# Altium schematic sheet Howland Channel 2.SchDoc
size A4
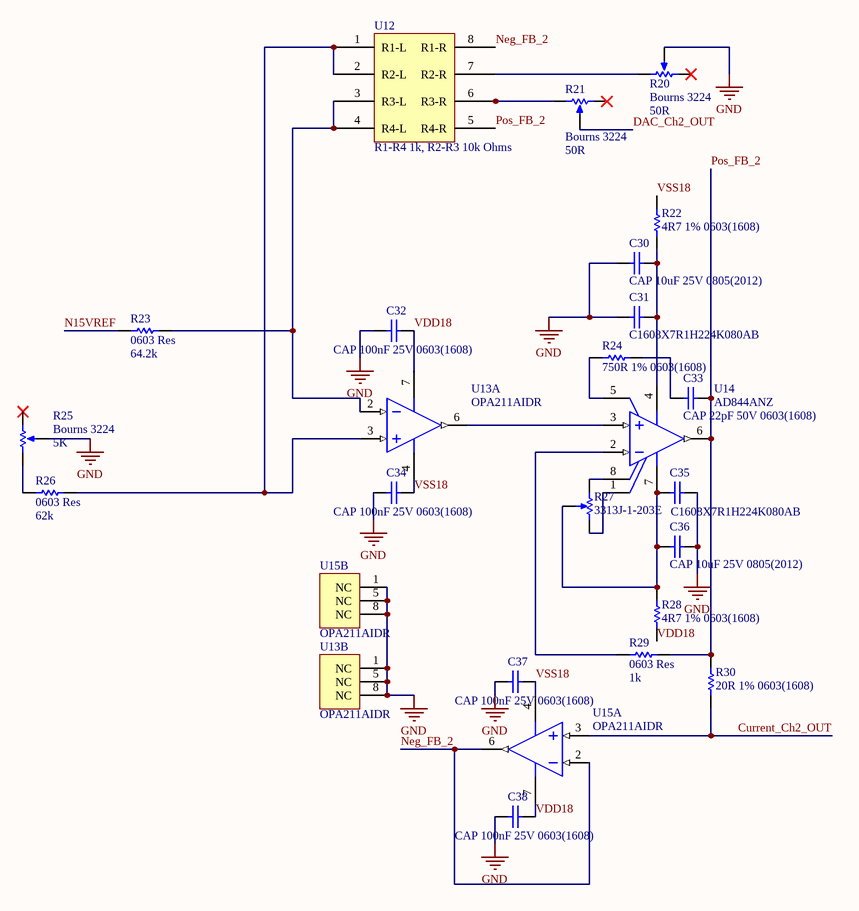
[diagram p0: Howland Channel 2.SchDoc]

## Parts
C30  CAP 10uF 25V 0805(2012)  [CAPC0805(2012)145_N]
C31  C1608X7R1H224K080AB  [TDK-C1608-2_A_M]
C32  CAP 100nF 25V 0603(1608)  [CAPC0603(1608)100_N]
C33  CAP 22pF 50V 0603(1608)  [CAPC0603(1608)100_M]
C34  CAP 100nF 25V 0603(1608)  [CAPC0603(1608)100_N]
C35  C1608X7R1H224K080AB  [TDK-C1608-2_A_M]
C36  CAP 10uF 25V 0805(2012)  [CAPC0805(2012)145_N]
C37  CAP 100nF 25V 0603(1608)  [CAPC0603(1608)100_N]
C38  CAP 100nF 25V 0603(1608)  [CAPC0603(1608)100_N]
R20  Bourns 3224  value 50R  [BOURNS 3224W]
R21  Bourns 3224  value 50R  [BOURNS 3224W]
R22  4R7 1% 0603(1608)  [RESC0603(1608)_M]
R23  0603 Res  value 64.2k  [J1-0603]
R24  750R 1% 0603(1608)  [RESC0603(1608)_L]
R25  Bourns 3224  value 5K  [BOURNS 3224W]
R26  0603 Res  value 62k  [J1-0603]
R27  3313J-1-203E  [BOUR-3313J-1_V]
R28  4R7 1% 0603(1608)  [RESC0603(1608)_M]
R29  0603 Res  value 1k  [J1-0603]
R30  20R 1% 0603(1608)  [RESC0603(1608)_M]
U12  R1-R4 1k, R2-R3 10k Ohms  [0612 (4x0603)]
U13  OPA211AIDR  [TI-D8_L]  (parts A,B of 2)
U14  AD844ANZ  [ADI-N-8]
U15  OPA211AIDR  [TI-D8_L]  (parts A,B of 2)

## Nets
GND: C30.1 C31.1 C32.1 C34.1 C35.2 C36.2 C37.1 C38.1 R20.2(TAP) R25.2(TAP) U13.1(NC) U13.5(NC) U13.8(NC) U15.1(NC) U15.5(NC) U15.8(NC)
Current_Ch2_OUT: R30.1 U15.3(IN+)
DAC_Ch2_OUT: R21.2(TAP)
N15VREF: R23.2
Neg_FB_2: U12.8(R1-R) U15.2(IN-) U15.6(OUT)
Pos_FB_2: C33.2 R29.1 R30.2 U12.5(R4-R) U14.6(OUTPUT)
VDD18: C32.2 C38.2 R28.1 U13.7(V+) U15.7(V+)
VSS18: C34.2 C37.2 R22.2 U13.4(V-) U15.4(V-)
NetC30_2: C30.2 C31.2 R22.1 U14.4(-VS)
NetC33_1: C33.1 R24.2
NetC35_1: C35.1 C36.1 R27.2 R28.2 U14.7(+VS)
NetR20_3: R20.3(BOT) U12.7(R2-R)
NetR21_1: R21.1(TOP) U12.6(R3-R)
NetR23_1: R23.1 U12.3(R3-L) U12.4(R4-L) U13.2(IN-)
NetR24_1: R24.1 U14.5(TZ)
NetR25_1: R25.1(TOP) R26.2
NetR26_1: R26.1 U12.1(R1-L) U12.2(R2-L) U13.3(IN+)
NetR27_1: R27.1 U14.8(NULL)
NetR27_3: R27.3 U14.1(NULL)
NetR29_2: R29.2 U14.2(-IN)
NetU13_6: U13.6(OUT) U14.3(+IN)

Not connected (* = marked no-connect by the designer): R20 1(TOP)*; R21 3(BOT)*; R25 3(BOT)*

## Library data of the parts
C30 C36 = CMP-1036-04932-1: CAP 10uF 25V ±10% 0805 (2012 Metric) Thickness 1.45mm SMD; Case-EIA: 0805; Case-Metric: 2012; Tolerance: Â±10%; Technology: SMT; Value: 10uF; Rated Voltage: 25 V; Max Thickness: 1.45 mm
C31 C35 = CMP-2000-05394-1: Cap Ceramic, 0.22 uF, +/- 10%, -55 to 125 degC, 2-Pin SMD (0603), RoHS, Tape and Reel; Manufacturer: TDK; PCN Part Number: MLCCPartNumberChange30/Nov/2012; Capacitance: 0.22µF; Other Names: 445-7408-1; Design Resources: 20WNon-IsolatedBuckLEDDriverUsingPLLNK460KG; Online Catalog: CSeries,GeneralPurpose; Kits: 445-9014-KIT-ND-KITMLCC100PF-22UF060310-50V445-9003-KIT-ND-KITCAPCERHICAPMLCCSMD445-173086-KIT-ND-C0402-2220X7R6.3-50V1,000PF-; Temperature Coefficient: X7R; Product Training Modules: CSeriesGeneralApplicationsSEAT,CCV,andTVCLDesignToolsGuidetoReplacinganElectrolyticCapacitorwithanMLCC; Voltage - Rated: 50V; Ratings: -; Lead Spacing: -; Package Description: 2-Pin Chip Capacitor, Body 1.7 x 0.9 mm; Datasheet URL: https://datasheet.ciiva.com/24218/c1608x7r1h224k080ab-264841-24218813.pdf; Applications: GeneralPurpose; Series: C; Manufacturer URL: http://www.tdk.com/; Features: -; Tolerance: ±10%; Package Reference: 603; Family: CeramicCapacitors; Standard Package: 1; RoHS Information: RoHSCertificate-MLCC; Package / Case: 0603(1608Metric); Operating Temperature: -55degC~125degC; Datasheet Version: Sep-13; Mounting Type: SurfaceMount,MLCC; Lead Style: -; Height - Seated (Max): -; Packaging: CutTape(CT); Category: Capacitors
C32 C34 C37 C38 = CMP-1035-02589-1: CAP 100nF 25V ±20% 0603 (1608 Metric) Thickness 1mm SMD; Case-EIA: 0603; Tolerance: Â±20%; Case-Metric: 1608; Value: 100nF; Max Thickness: 1 mm; Technology: SMT; Rated Voltage: 25 V
C33 = CMP-1035-00820-1: CAP 22pF 50V ±2% 0603 (1608 Metric) Thickness 1mm SMD; Case-Metric: 1608; Case-EIA: 0603; Tolerance: Â±2%; Rated Voltage: 50 V; Value: 22pF; Technology: SMT; Max Thickness: 1 mm
R20 R21 R25 = 3224-Series Trimmer Potentiometer: Trimmer Potentiometer, Cermet, 3224-Series (Bourns); Sim Note: Enter the Resistance value and the set point into parameter fields.; Set Position: 0.5; Published: 8-Jun-2000; LatestRevisionDate: 17-Jul-2002; LatestRevisionNote: Re-released for DXP Platform.; PackageReference: VR5; Publisher: Altium Limited; PackageDescription: Variable Resistor, Thru-Hole; 3 Leads
R22 R28 = CMP-1012-00247-1: 4R7 0.1W 1% 0603 (1608 Metric)  SMD; Case-EIA: 0603; Case-Metric: 1608; Value: 4.70 Ohm; Power: 0.1 W; Technology: SMT; Tolerance: 1 %
R23 R26 R29 = Res1: Chip Resistor, 0603, 1%; Published: 8-Jun-2000; LatestRevisionDate: 17-Jul-2002; LatestRevisionNote: Re-released for DXP Platform.; PackageReference: AXIAL-0.3; Publisher: Altium Limited; PackageDescription: Axial Device, Thru-Hole; 2 Leads; 0.3 in Pin Spacing
R24 = CMP-1012-00496-1: 750R 0.1W 1% 0603 (1608 Metric)  SMD; Value: 750.00 Ohm; Case-Metric: 1608; Case-EIA: 0603; Technology: SMT; Tolerance: 1 %; Power: 0.1 W
R27 = CMP-2000-05586-1: 3 mm Trimpot(R) Trimming Potentiometer, 20 KOhm, +/- 20%, 0.125 W, -55 to 125 degC, 3-Pin SMD, RoHS, Tape and Reel; Manufacturer: Bourns; Insulation Resistance: 100Megohms(Min.)@500VDC; Rotational Life: 100Cycles; Resolution: Infinite; Brand/Series: Trimpot®3313-SealedSeries; Temperature, Operating, Maximum: +125°C; Resistance: 20Kilohms; Resistance, Insulation: 100Megohms; Material, Element: Cermet; Standards: RoHSCompliant; Dielectric Strength: 500VAC; Load Life: 1000hr@0.125W,70°C; Torque: 50g-cm; Temperature Coefficient: ±100ppm/°C; Number of Turns: 1; Power, Rating: 0.125W; Angle, Mechanical: 250°; Temperature, Operating, Minimum: -55°C; Package Reference: 3313J-1; Tolerance: ±20%; Type: Trimmer; Package Description: 3-Pin Surface Mount Device, Body 3.5 x 3.2 mm, Pitch 1.15 mm; Mounting Technology: SurfaceMount; Datasheet URL: http://www.bourns.com/docs/Product-Datasheets/3313.pdf; Mounting Type: SurfaceMount; Manufacturer URL: http://www.bourns.com/; Datasheet Version: 05/2016; Termination: SMD
R30 = CMP-1012-00316-1: 20R 0.1W 1% 0603 (1608 Metric)  SMD; Case-EIA: 0603; Case-Metric: 1608; Value: 20.00 Ohm; Technology: SMT; Tolerance: 1 %; Power: 0.1 W
U12 = VISHAY ACAS: Matched Resistor Network, Isolated, multi-0603 package, Abs Tol 0.1%, Rel Tol 0.05%
U13 U15 = CMP-0272-00537-2: 1.1 nV/rtHz Noise, Low Power, Precision Operational Amplifier, 4.5 to 36 V, -40 to 125 degC, 8-pin SOIC (D8), Green (RoHS & no Sb/Br); Manufacturer: Texas Instruments; Total Supply Voltage(Min)(+5V is 5, +/-5V is 10): 4.5; Number of Channels: 1; Offset Drift(Typ)(uV/C): 0.15; GBW(Typ)(MHz): 45; Slew Rate(Typ)(V/us): 27; Sub Family: High Supply Voltage Amplifier (>=30V), Low Noise Amp (<=10nV/rtHz), Low Offset Voltage Amplifier (<=500uV), Precision Amplifier; Rating: Catalog; IIB(Max)(pA): 175000; Vio (25C)(Max)(mV): 0.125; Packing: LARGE T&R; Total Supply Voltage(Max)(+5V is 5, +/-5V is 10): 36; CMRR(Min)(dB): 114; Eco-Plan: Green (RoHS & no Sb/Br); DatasheetVersion: SBOS377G; Iq per channel(Max)(mA): 4.5; ComponentLink2URL: http://www.ti.com/lit/ds/symlink/opa211.pdf; ComponentLink1Description: Manufacturer URL; ComponentLink3Description: Package Specification; Code_JEDEC: MS-012; ComponentLink3URL: http://www.ti.com/litv/pdf/msoi002j; PartNumber: OPA211AIDR; ComponentLink2Description: Datasheet; PackageReference: D8; PackageVersion: 4040047-3/M, 06/2011; ComponentLink1URL: http://www.ti.com/; Mounting Technology: Surface Mount; PackageDescription: 8-Pin Plastic Small Outline, Body 4.9 x 3.9 mm, Pitch 1.27 mm; PartId: 1
U14 = CMP-0384-00240-1: Single Channel Wide Bandwidth Operational Amplifier, 60 MHz BW, 2 KV/us SR, Industrial, 8-pin DIP (N-8), Tube; Generic Part Number: AD844; Manufacturer: Analog Devices; Amplifiers Per Package: 1; Small Signal Bandwidth: 60MHz; Iq/Amp: 6.5mA; V Span Max: 36V; V Span Min: 9V; Slew Rate: 2KV/us; Input Bias Current: 150nA; Input Offset Voltage: 50uV; Code_JEDEC: MS-001; PackageDescription: 8-Pin Plastic Dual In-Line Package, Row spacing 7.62 mm, Pitch 2.54 mm; DatasheetVersion: Rev. F; ComponentLink2URL: http://www.analog.com/static/imported-files/data_sheets/AD844.pdf; PackageReference: N-8; ComponentLink2Description: Datasheet; PartNumber: AD844ANZ; ComponentLink1URL: http://www.analog.com/en/index.html; ComponentLink3Description: Package Specification; Mounting Technology: Through Hole; ComponentLink3URL: http:/www.analog.com/static/imported-files/packages/PKG_PDF/PDIP(N)/N_8.pdf; ComponentLink1Description: Manufacturer URL; PackageVersion: 070606-A; Packing: Tube